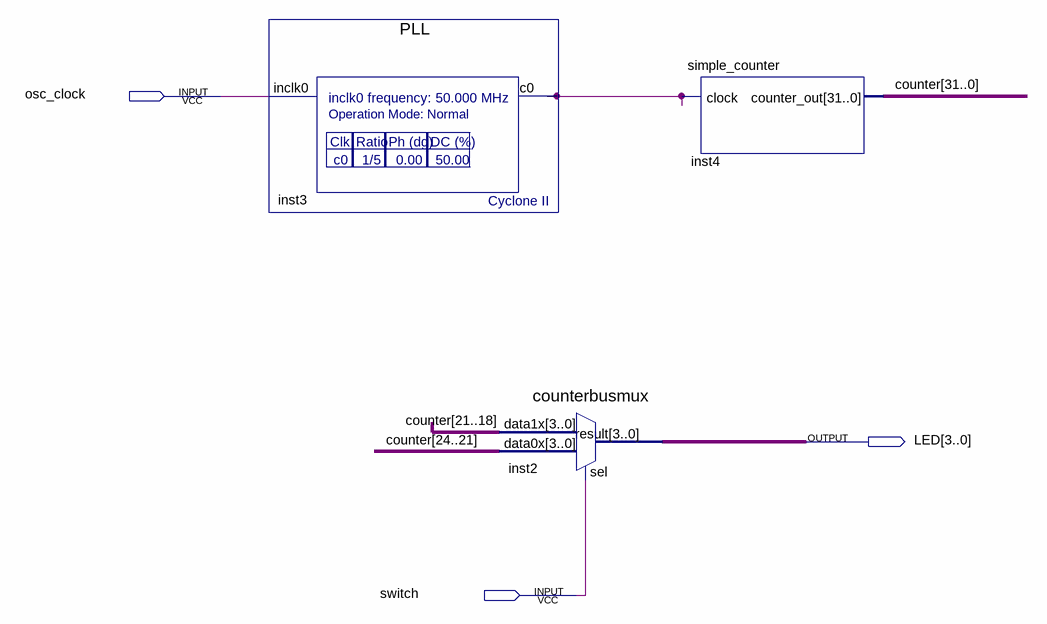
[diagram p0: schematic sheet]
// Quartus schematic 1st_Project.bdf as structural Verilog: 3 symbols, 3 pins
module \1st_Project  (
  input  osc_clock,
  input  switch,
  output [3:0] LED
);

  wire inst3_c0;
  wire [31:0] counter;

  PLL inst3 (.inclk0(osc_clock), .c0(inst3_c0));
  counterbusmux inst2 (.data1x(counter[21:18]), .data0x(counter[24:21]), .sel(switch), .result(LED));
  simple_counter inst4 (.clock(inst3_c0), .counter_out(counter));
endmodule
